# EAGLE schematic w15_node2 (EAGLE 8.0.1)
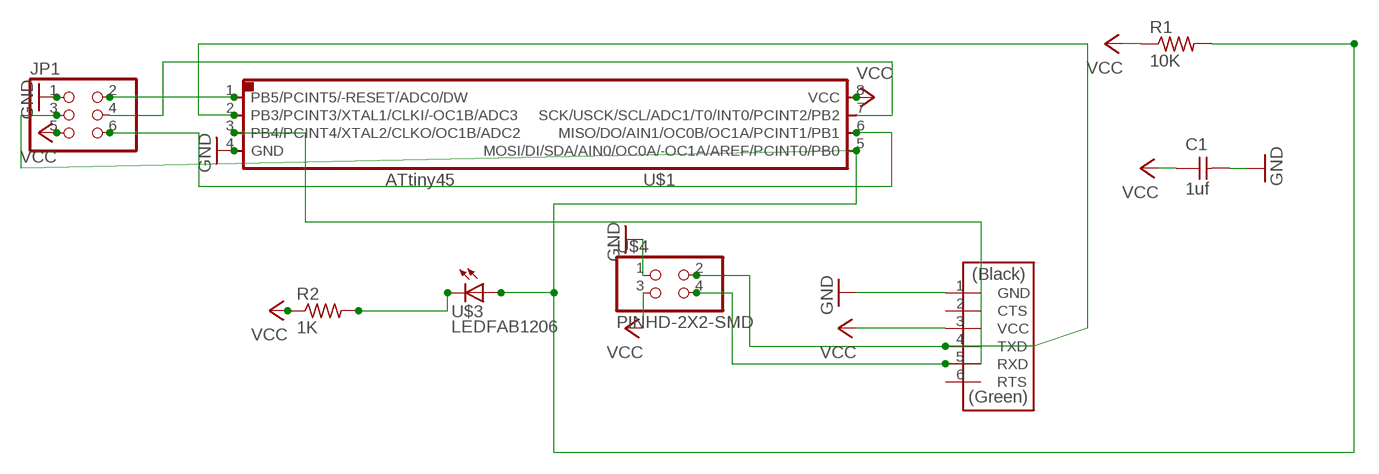
[diagram p0: schematic, sheet 1]

## Parts
C1  1uf  CAP-UNPOLARIZEDFAB  [C1206FAB]
JP1  PINHD-2X3-SMD  [2X03SMD]
R1  10K  RES-US1206FAB  [R1206FAB]
R2  1K  RES-US1206FAB  [R1206FAB]
U$1  ATTINY45SI  [SOIC8]
U$2  FTDI-SMD-HEADER  [1X06SMD]
U$3  LEDFAB1206  [LED1206FAB]
U$4  PINHD-2X2-SMD  [2X02SMD]

## Nets
GND: C1.2 JP1.1 U$1.4(GND) U$2.1(GND) U$4.1
N$1: U$1.2(PB3/PCINT3/XTAL1/CLKI/-OC1B/ADC3) U$2.4(TXD) U$4.2
N$2: U$1.3(PB4/PCINT4/XTAL2/CLKO/OC1B/ADC2) U$2.5(RXD) U$4.4
N$3: JP1.4 U$1.7(SCK/USCK/SCL/ADC1/T0/INT0/PCINT2/PB2)
N$4: JP1.3 R1.2 U$1.5(MOSI/DI/SDA/AIN0/OC0A/-OC1A/AREF/PCINT0/PB0) U$3.1(A)
N$6: JP1.2 U$1.1(PB5/PCINT5/-RESET/ADC0/DW)
N$7: JP1.6 U$1.6(MISO/DO/AIN1/OC0B/OC1A/PCINT1/PB1)
N$8: R2.2 U$3.2(C)
VCC: C1.1 JP1.5 R1.1 R2.1 U$1.8(VCC) U$2.3(VCC) U$4.3
Unconnected: U$2.2(CTS) U$2.6(RTS)

## Library data of the parts
C1 = fab:CAP-UNPOLARIZED
JP1 = fab:PINHD-2X3-SMD: PIN HEADER
R1 R2 = fab:RES-US: Resistor (US Symbol) Variants with postfix FAB are widened to allow the routing of internal traces
U$1 = fab:ATTINY45
U$2 = fab:FTDI-SMD-HEADER
U$3 = fab:LED: LED
U$4 = fab:PINHD-2X2-SMD